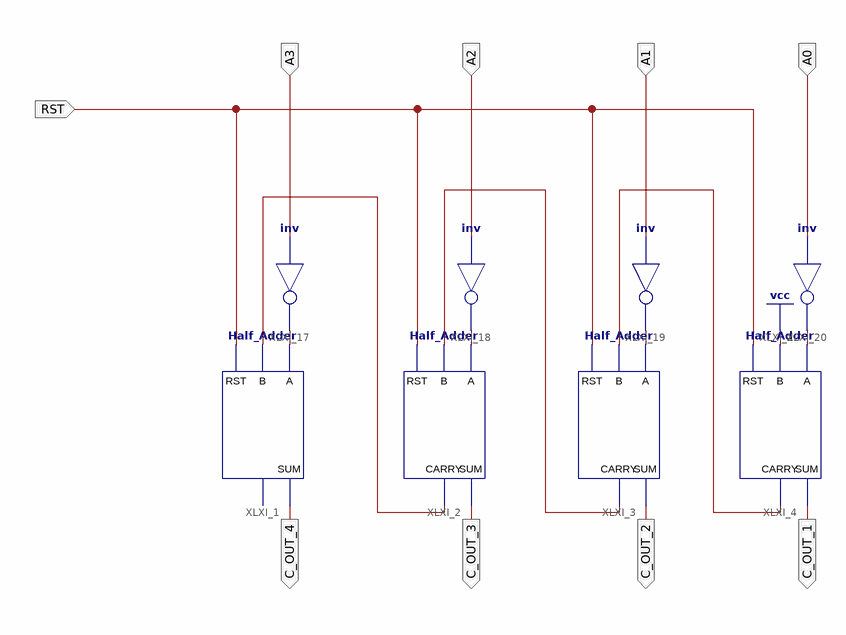
[diagram p0: schematic sheet 1]
// Xilinx ISE schematic Twos_Complement.sch (spartan6) as structural Verilog: 8 symbols, 9 ports
module Twos_Complement (
  input  A3,
  input  A2,
  input  A1,
  input  RST,
  input  A0,
  output C_OUT_4,
  output C_OUT_3,
  output C_OUT_2,
  output C_OUT_1
);

  wire XLXN_12, XLXN_13, XLXN_14, XLXN_15, XLXN_23, XLXN_24, XLXN_25;

  Half_Adder XLXI_1 (.A(XLXN_12), .B(XLXN_25), .RST(RST), .SUM(C_OUT_4));  // open: CARRY
  Half_Adder XLXI_4 (.A(XLXN_15), .B(1'b1), .CARRY(XLXN_23), .RST(RST), .SUM(C_OUT_1));
  Half_Adder XLXI_2 (.A(XLXN_13), .B(XLXN_24), .CARRY(XLXN_25), .RST(RST), .SUM(C_OUT_3));
  Half_Adder XLXI_3 (.A(XLXN_14), .B(XLXN_23), .CARRY(XLXN_24), .RST(RST), .SUM(C_OUT_2));
  not XLXI_17 (XLXN_12, A3);
  not XLXI_18 (XLXN_13, A2);
  not XLXI_19 (XLXN_14, A1);
  not XLXI_20 (XLXN_15, A0);
endmodule
